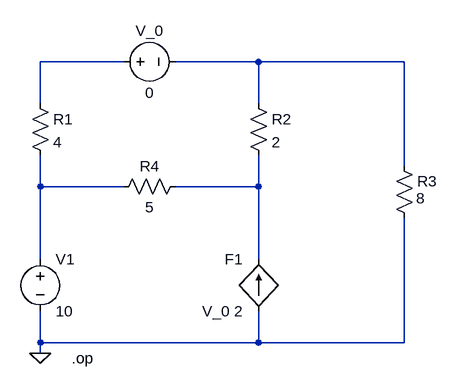
[diagram p0: schematic CH03-KP2-02.asc]
CH03-KP2-02.asc, the LTspice schematic file:
Version 4
SHEET 1 880 680
WIRE 16 96 -112 96
WIRE 224 96 96 96
WIRE 448 96 224 96
WIRE -112 160 -112 96
WIRE 224 160 224 96
WIRE 448 256 448 96
WIRE -112 288 -112 240
WIRE 16 288 -112 288
WIRE 224 288 224 240
WIRE 224 288 96 288
WIRE -112 400 -112 288
WIRE 224 400 224 288
WIRE -112 528 -112 480
WIRE 224 528 224 480
WIRE 224 528 -112 528
WIRE 448 528 448 336
WIRE 448 528 224 528
WIRE -112 544 -112 528
FLAG -112 544 0
DATAFLAG -112 288 "$"
DATAFLAG 224 288 "$"
DATAFLAG 224 96 "$"
SYMBOL res -128 144 R0
SYMATTR InstName R1
SYMATTR Value 4
SYMBOL res 208 144 R0
SYMATTR InstName R2
SYMATTR Value 2
SYMBOL res 432 240 R0
WINDOW 3 34 66 Left 2
SYMATTR InstName R3
SYMATTR Value 8
SYMBOL res 112 272 R90
WINDOW 0 0 56 VBottom 2
WINDOW 3 32 56 VTop 2
SYMATTR InstName R4
SYMATTR Value 5
SYMBOL voltage -112 384 R0
SYMATTR InstName V1
SYMATTR Value 10
SYMBOL voltage 0 96 R270
WINDOW 0 32 56 VTop 2
WINDOW 3 -32 56 VBottom 2
SYMATTR InstName V_0
SYMATTR Value 0
SYMBOL f 224 480 R180
WINDOW 0 24 80 Left 2
WINDOW 3 24 0 Left 2
SYMATTR InstName F1
SYMATTR Value V_0 2
TEXT -64 552 Left 2 !.op

The netlist it stands for:
* CH03-KP2-02.asc
R1 N001 N003 4
R2 N002 N004 2
R3 N002 0 8
R4 N004 N003 5
V1 N003 0 10
V_0 N001 N002 0
F1 0 N004 V_0 2
.op
.backanno
.end